# EasyEDA Pro project YTMR4040_3电阻开发板100x100mm_1028打板.eprj, schematic Schematic1
Create Date: 2023-09-04; Page Name: P1; Project Name: YTMR4040_3电阻开发板100x100mm_1028打板; Schematic Name: Schematic1; Update Date: 2024-03-18; Company: 云图半导体; Page Size: A4; Version: V1.0
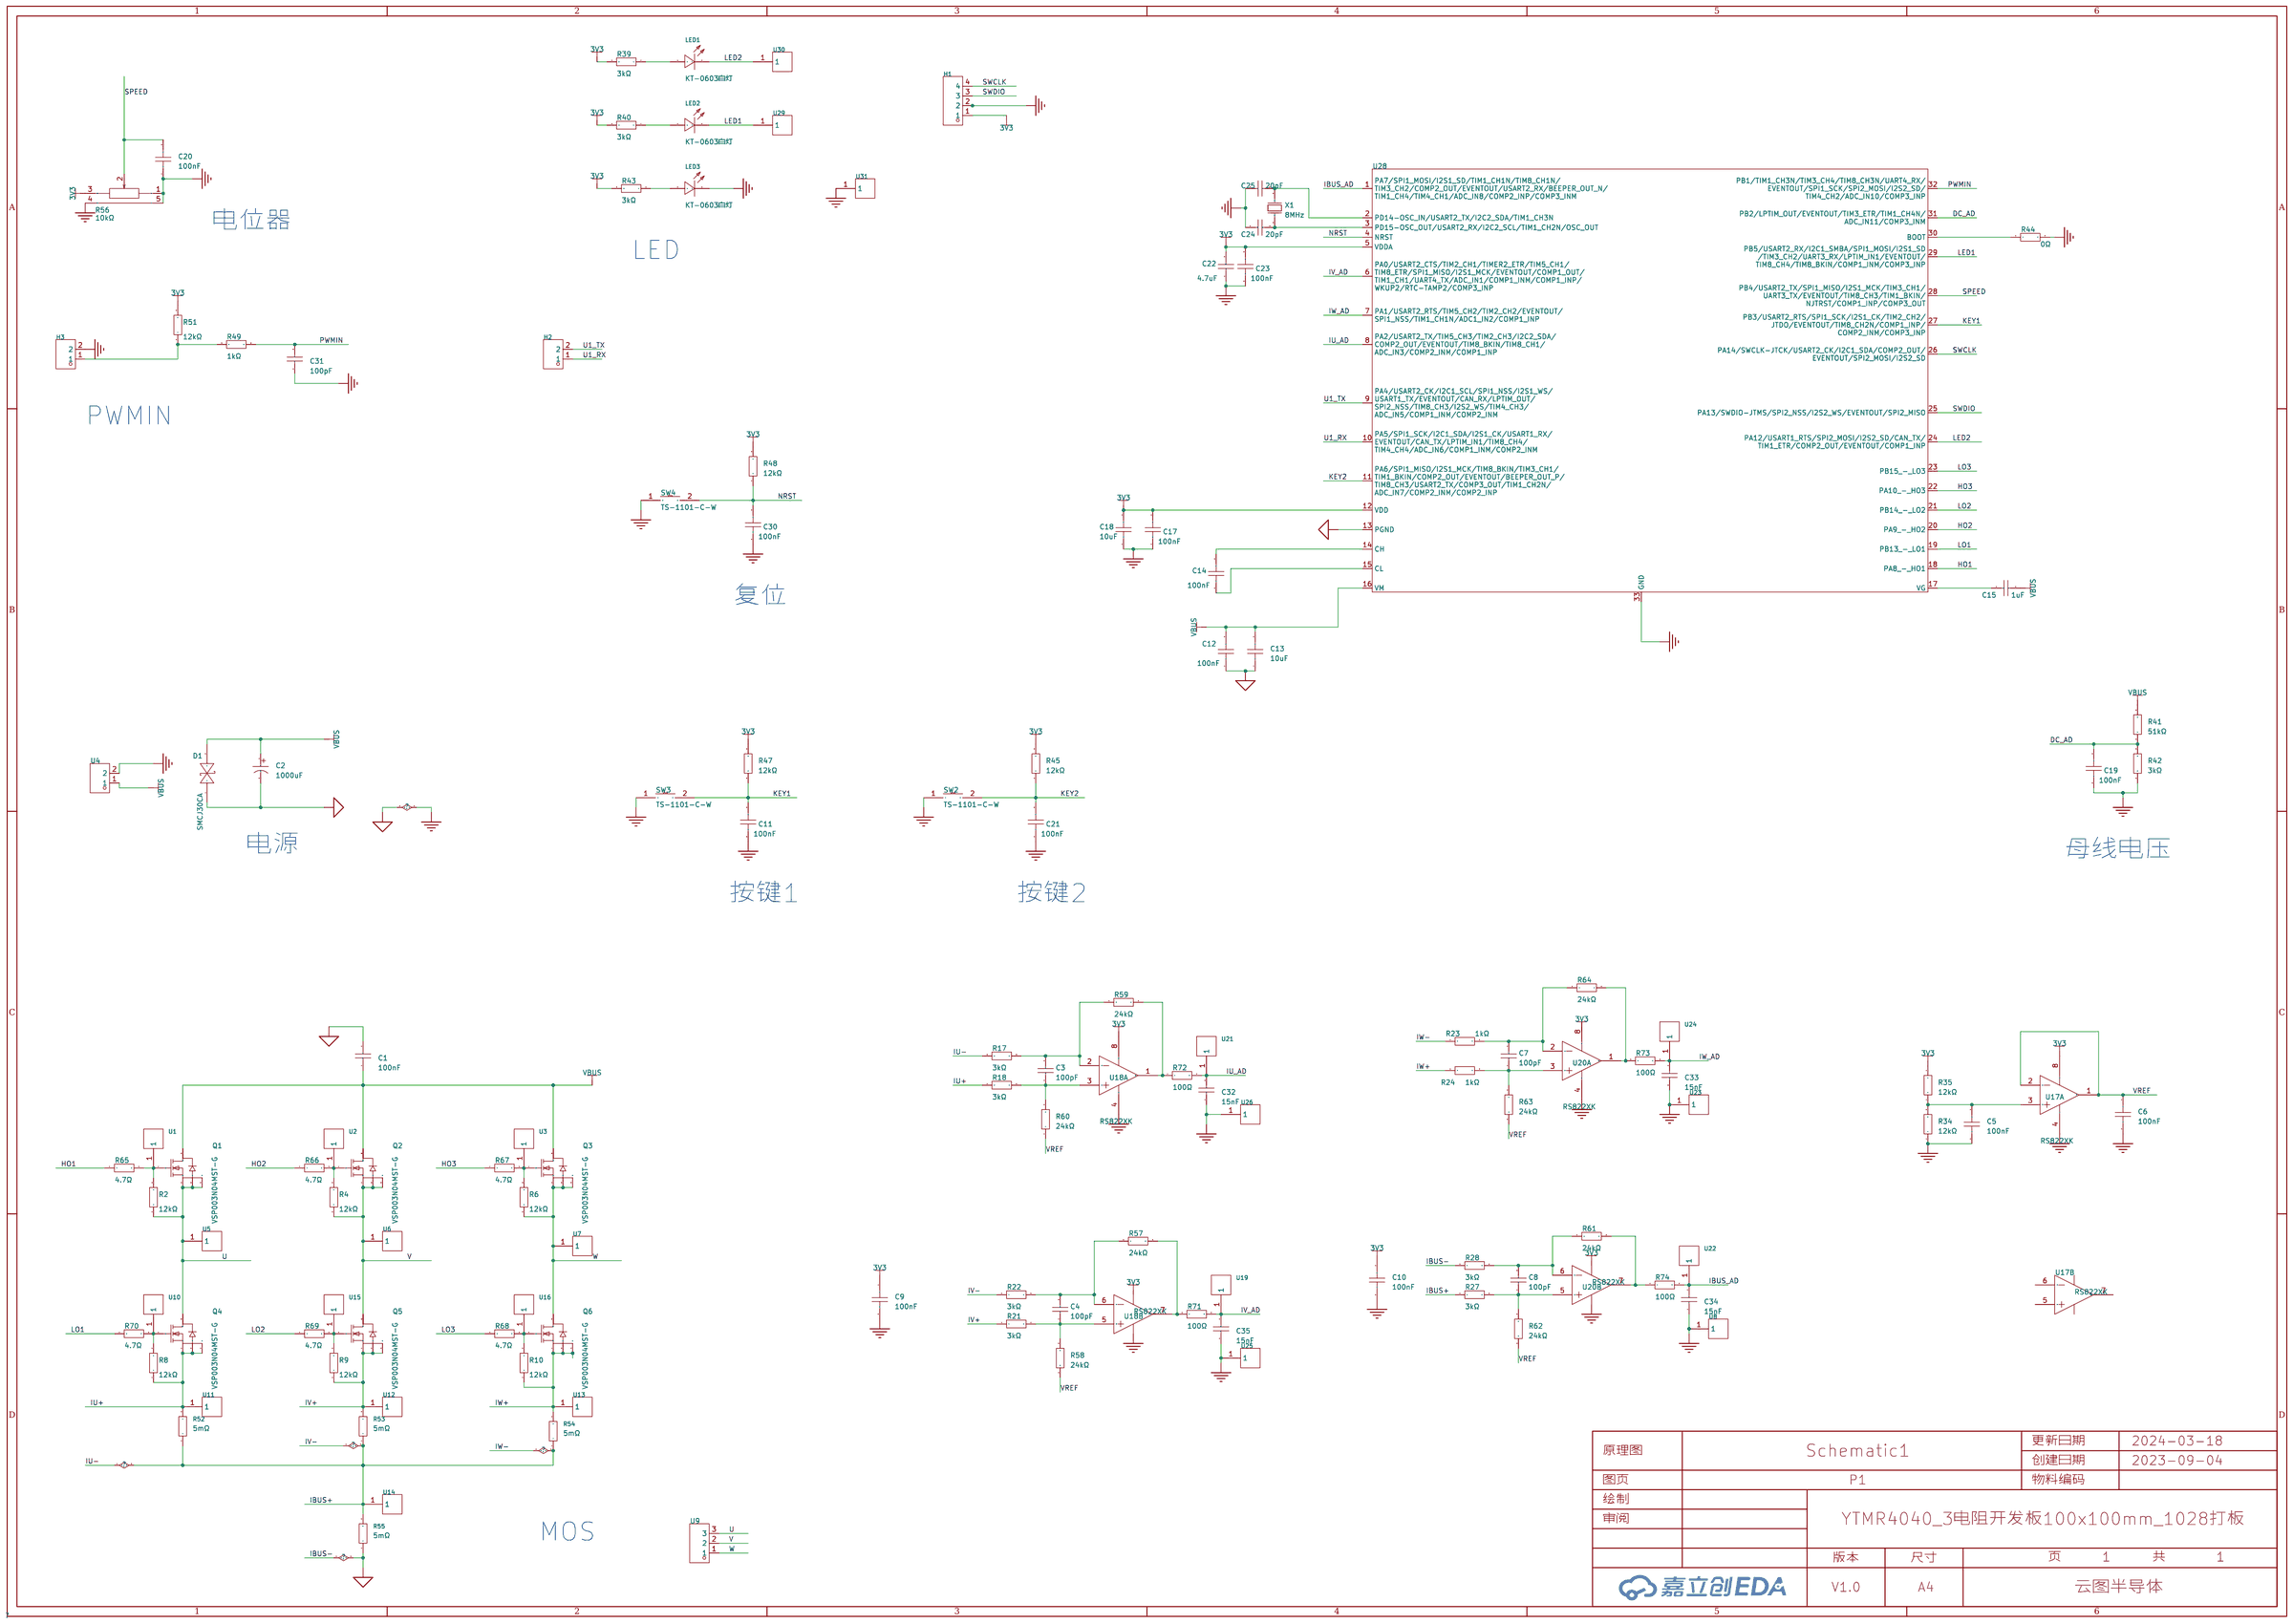
[diagram p0: schematic sheet]

## Parts
C1  100nF  [C1206]
C2  1000uF  [CAP-TH_BD12.5-P5.00-D0.6-FD]
C3  100pF  [C0603]
C4  100pF  [C0603]
C5  100nF  [C0603]
C6  100nF  [C0603]
C7  100pF  [C0603]
C8  100pF  [C0603]
C9  100nF  [C0603]
C10  100nF  [C0603]
C11  100nF  [C0603]
C12  100nF  [C0603]
C13  10uF  [C0603]
C14  100nF  [C0603]
C15  1uF  [C0603]
C17  100nF  [C0603]
C18  10uF  [C0603]
C19  100nF  [C0603]
C20  100nF  [C0603]
C21  100nF  [C0603]
C22  4.7uF  [C0603]
C23  100nF  [C0603]
C24  20pF  [C0603]
C25  20pF  [C0603]
C30  100nF  [C0603]
C31  100pF  [C0603]
C32  15nF  [C0603]
C33  15nF  [C0603]
C34  15nF  [C0603]
C35  15nF  [C0603]
D1  SMCJ30CA  [SMC_L6.9-W5.9-LS7.9-BI]
H1  X6511WV-04H-C60D30  [HDR-TH_4P-P2.54-V-M]
H2  PZ254V-11-02P  [HDR-TH_2P-P2.54-V-M]
H3  PZ254V-11-02P  [HDR-TH_2P-P2.54-V-M]
LED1  KT-0603白灯  [LED0603-R-RD_WHITE]
LED2  KT-0603白灯  [LED0603-R-RD_WHITE]
LED3  KT-0603白灯  [LED0603-R-RD_WHITE]
Q1  VSP003N04MST-G  [DFN-8_L5.8-W4.9-P1.27-LS6.1-BL]
Q2  VSP003N04MST-G  [DFN-8_L5.8-W4.9-P1.27-LS6.1-BL]
Q3  VSP003N04MST-G  [DFN-8_L5.8-W4.9-P1.27-LS6.1-BL]
Q4  VSP003N04MST-G  [DFN-8_L5.8-W4.9-P1.27-LS6.1-BL]
Q5  VSP003N04MST-G  [DFN-8_L5.8-W4.9-P1.27-LS6.1-BL]
Q6  VSP003N04MST-G  [DFN-8_L5.8-W4.9-P1.27-LS6.1-BL]
R2  12kΩ  [R0603]
R4  12kΩ  [R0603]
R6  12kΩ  [R0603]
R8  12kΩ  [R0603]
R9  12kΩ  [R0603]
R10  12kΩ  [R0603]
R17  3kΩ  [R0603]
R18  3kΩ  [R0603]
R21  3kΩ  [R0603]
R22  3kΩ  [R0603]
R23  1kΩ  [R0603]
R24  1kΩ  [R0603]
R27  3kΩ  [R0603]
R28  3kΩ  [R0603]
R34  12kΩ  [R0603]
R35  12kΩ  [R0603]
R39  3kΩ  [R0603]
R40  3kΩ  [R0603]
R41  51kΩ  [R0603]
R42  3kΩ  [R0603]
R43  3kΩ  [R0603]
R44  0Ω  [R0603]
R45  12kΩ  [R0603]
R47  12kΩ  [R0603]
R48  12kΩ  [R0603]
R49  1kΩ  [R0603]
R51  12kΩ  [R0603]
R52  5mΩ  [R2512]
R53  5mΩ  [R2512]
R54  5mΩ  [R2512]
R55  5mΩ  [R2512]
R56  10kΩ  [RES-TH_RK09K1130A70]
R57  24kΩ  [R0603]
R58  24kΩ  [R0603]
R59  24kΩ  [R0603]
R60  24kΩ  [R0603]
R61  24kΩ  [R0603]
R62  24kΩ  [R0603]
R63  24kΩ  [R0603]
R64  24kΩ  [R0603]
R65  4.7Ω  [R0603]
R66  4.7Ω  [R0603]
R67  4.7Ω  [R0603]
R68  4.7Ω  [R0603]
R69  4.7Ω  [R0603]
R70  4.7Ω  [R0603]
R71  100Ω  [R0603]
R72  100Ω  [R0603]
R73  100Ω  [R0603]
R74  100Ω  [R0603]
SW2  TS-1101-C-W  [SW-SMD_L6.0-W3.3-LS8.0]
SW3  TS-1101-C-W  [SW-SMD_L6.0-W3.3-LS8.0]
SW4  TS-1101-C-W  [SW-SMD_L6.0-W3.3-LS8.0]
U1  RH-5000  [TEST-TH_BD2.54-P1.4_RED]
U2  RH-5000  [TEST-TH_BD2.54-P1.4_RED]
U3  RH-5000  [TEST-TH_BD2.54-P1.4_RED]
U4  DB128L-5.08-2P-GN-S  [CONN-TH_2P-P5.08_DB128L-5.08-2P]
U5  RH-5000  [TEST-TH_BD2.54-P1.4_RED]
U6  RH-5000  [TEST-TH_BD2.54-P1.4_RED]
U7  RH-5000  [TEST-TH_BD2.54-P1.4_RED]
U8  RH-5000  [TEST-TH_BD2.54-P1.4_RED]
U9  XY128V-A-5.08-3P  [CONN-TH_XY128V-A-5.08-3P]
U10  RH-5000  [TEST-TH_BD2.54-P1.4_RED]
U11  RH-5000  [TEST-TH_BD2.54-P1.4_RED]
U12  RH-5000  [TEST-TH_BD2.54-P1.4_RED]
U13  RH-5000  [TEST-TH_BD2.54-P1.4_RED]
U14  RH-5000  [TEST-TH_BD2.54-P1.4_RED]
U15  RH-5000  [TEST-TH_BD2.54-P1.4_RED]
U16  RH-5000  [TEST-TH_BD2.54-P1.4_RED]
U17  RS822XK  [SOP-8_L4.9-W3.9-P1.27-LS6.0-BL]  (sections 1,2)
U18  RS822XK  [SOP-8_L4.9-W3.9-P1.27-LS6.0-BL]  (sections 1,2)
U19  RH-5000  [TEST-TH_BD2.54-P1.4_RED]
U20  RS822XK  [SOP-8_L4.9-W3.9-P1.27-LS6.0-BL]  (sections 1,2)
U21  RH-5000  [TEST-TH_BD2.54-P1.4_RED]
U22  RH-5000  [TEST-TH_BD2.54-P1.4_RED]
U23  RH-5000  [TEST-TH_BD2.54-P1.4_RED]
U24  RH-5000  [TEST-TH_BD2.54-P1.4_RED]
U25  RH-5000  [TEST-TH_BD2.54-P1.4_RED]
U26  RH-5000  [TEST-TH_BD2.54-P1.4_RED]
U28  -  [QFN-32_L4.0-W4.0-P0.40-BL-EP2.7]
U29  RH-5000  [TEST-TH_BD2.54-P1.4_RED]
U30  RH-5000  [TEST-TH_BD2.54-P1.4_RED]
U31  RH-5000  [TEST-TH_BD2.54-P1.4_RED]
X1  8MHz  [CRYSTAL-SMD_L5.0-W3.2]

## Library data of the parts
C1 = CL31B104KBCNNNC: 容值:100nF;精度:±10%;额定电压:50V;材质(温度系数):X7R;; LCSC Part Name: 100nF ±10% 50V; Supplier Part: C24497; Manufacturer: SAMSUNG(三星); Supplier Footprint: 1206; JLCPCB Part Class: 基础库; Datasheet: https://atta.szlcsc.com/upload/public/pdf/source/20160103/1457707712356.pdf; Supplier: LCSC; Tolerance: ±10%; Voltage Rated: 50V; Temperature Coefficient: X7R
C2 = ERS1VM102W20OT: 容值:1000uF;精度:±20%;额定电压:35V;; LCSC Part Name: 1000uF ±20% 35V; Supplier Part: C106695; Manufacturer: AISHI(艾华集团); Supplier Footprint: 插件,D12.5xL20mm; JLCPCB Part Class: 扩展库; Datasheet: https://atta.szlcsc.com/upload/public/pdf/source/20170415/1492238221653.pdf; Supplier: LCSC; Tolerance: ±20%; Rated Voltage: 35V; φD: 12.5mm; L: 20mm; Lead Spacing: 5mm; Lifetime @ Temp: 10000hrs@105℃
C3 C4 C7 C8 C31 = CL10C101JB8NNNC: 容值:100pF;精度:±5%;额定电压:50V;材质(温度系数):C0G;; LCSC Part Name: 100pF ±5% 50V; Supplier Part: C14858; Manufacturer: SAMSUNG(三星); Supplier Footprint: 0603; JLCPCB Part Class: 基础库; Datasheet: https://atta.szlcsc.com/upload/public/pdf/source/20160103/1457707672333.pdf; Supplier: LCSC; Tolerance: ±5%; Voltage Rated: 50V; Temperature Coefficient: C0G
C5 C6 C9-C12 C14 C17 C19-C21 C23 C30 = CC0603KRX7R9BB104: 容值:100nF;精度:±10%;额定电压:50V;材质(温度系数):X7R;; LCSC Part Name: 100nF ±10% 50V; Supplier Part: C14663; Manufacturer: YAGEO(国巨); Supplier Footprint: 0603; JLCPCB Part Class: 基础库; Datasheet: https://atta.szlcsc.com/upload/public/pdf/source/20180910/C282072_33301C7F631E79921B82A8DAC6BCC5B3.pdf; Supplier: LCSC; Tolerance: ±10%; Voltage Rated: 50V; Temperature Coefficient: X7R
C13 = GRM188R6YA106MA73D: 容值:10uF;精度:±20%;额定电压:35V;材质(温度系数):-;; LCSC Part Name: 10uF ±20% 35V; Supplier Part: C194427; Manufacturer: muRata(村田); Supplier Footprint: 0603; JLCPCB Part Class: 扩展库; Datasheet: https://atta.szlcsc.com/upload/public/pdf/source/20210128/C194427_FCA3640823207DDB58700A82F1A19B5F.pdf; Supplier: LCSC; Tolerance: ±20%; Voltage Rated: 35V
C15 = CL10A105KB8NNNC: 容值:1uF;精度:±10%;额定电压:50V;材质(温度系数):X5R;; LCSC Part Name: 1uF ±10% 50V; Supplier Part: C15849; Manufacturer: SAMSUNG(三星); Supplier Footprint: 0603; JLCPCB Part Class: 基础库; Datasheet: https://atta.szlcsc.com/upload/public/pdf/source/20160103/1457707679084.pdf; Supplier: LCSC; Tolerance: ±10%; Voltage Rated: 50V; Temperature Coefficient: X5R
C18 = CL10A106MA8NRNC: 容值:10uF;精度:±20%;额定电压:25V;材质(温度系数):X5R;; LCSC Part Name: 10uF ±20% 25V; Supplier Part: C96446; Manufacturer: SAMSUNG(三星); Supplier Footprint: 0603; JLCPCB Part Class: 基础库; Datasheet: https://atta.szlcsc.com/upload/public/pdf/source/20170325/1490427913016.pdf; Supplier: LCSC; Tolerance: ±20%; Voltage Rated: 25V; Temperature Coefficient: X5R
C22 = CL10A475KO8NNNC: 容值:4.7uF;精度:±10%;额定电压:16V;材质(温度系数):X5R;; LCSC Part Name: 4.7uF ±10% 16V; Supplier Part: C19666; Manufacturer: SAMSUNG(三星); Supplier Footprint: 0603; JLCPCB Part Class: 基础库; Datasheet: https://atta.szlcsc.com/upload/public/pdf/source/20160103/1457707703134.pdf; Supplier: LCSC; Tolerance: ±10%; Voltage Rated: 16V; Temperature Coefficient: X5R
C24 C25 = CL10C200JB8NNNC: 容值:20pF;精度:±5%;额定电压:50V;材质(温度系数):C0G;; LCSC Part Name: 20pF ±5% 50V; Supplier Part: C1648; Manufacturer: SAMSUNG(三星); Supplier Footprint: 0603; JLCPCB Part Class: 基础库; Datasheet: https://atta.szlcsc.com/upload/public/pdf/source/20160103/1457707686863.pdf; Supplier: LCSC; Tolerance: ±5%; Voltage Rated: 50V; Temperature Coefficient: C0G
C32-C35 = CC0603KRX7R9BB153: 容值:15nF;精度:±10%;额定电压:50V;材质(温度系数):X7R;; LCSC Part Name: 15nF ±10% 50V; Supplier Part: C107076; Manufacturer: YAGEO(国巨); Supplier Footprint: 0603; JLCPCB Part Class: 扩展库; Datasheet: https://atta.szlcsc.com/upload/public/pdf/source/20170420/1492670712000.pdf; Supplier: LCSC; Tolerance: ±10%; Voltage Rated: 50V; Temperature Coefficient: X7R
D1 = SMCJ30CA_C438211: 极性:双向;; LCSC Part Name: 双向; Supplier Part: C438211; Manufacturer: 晶导微电子; Supplier Footprint: SMC; JLCPCB Part Class: 扩展库; Datasheet: https://atta.szlcsc.com/upload/public/pdf/source/20191016/C438211_C3D86C316A65B072EF4CC33C301A4EED.pdf; Supplier: LCSC; Polarity: 双向
H1 = X6511WV-04H-C60D30: 排数:单排;总PIN位数:4P;间距:2.54mm;插针结构:1x4P;行距:-;安装类型:直插;圆针/方针:方针;额定电流:3A;额定电压:250V;配合针长度:6mm;塑高:2.5mm;端接针长度:3mm;触头材质:黄铜;触头镀层:金;工作温度范围:-40℃~+105℃;焊接温度(最大值):260℃;颜色:黑色;; LCSC Part Name: 2.54mm 1x4P 直插 方针 镀金足1U; Supplier Part: C706876; Manufacturer: XKB Connectivity(中国星坤); Supplier Footprint: 插件,P=2.54mm; JLCPCB Part Class: 扩展库; Datasheet: https://atta.szlcsc.com/upload/public/pdf/source/20211009/D19569EFFEB9776B42364DF7D41FD96A.pdf; Supplier: LCSC; Number of Rows: 单排; Number of Pins: 4P; Pitch: 2.54mm; Pin Structure: 1x4P; Mounting Type: 直插; Circluar Pins/Square Pins: 方针; Current Rating (Max): 3A; Voltage Rating (Max): 250V; Length of Mating Pin: 6mm; Insulation Height: 2.5mm; Length of End Connection Pin: 3mm; Contact Material: 黄铜; Contact Plating: 金; Operating Temperature Range: -40℃~+105℃; Welding Temperature (Max): 260℃; Color: 黑色
H2 H3 = PZ254V-11-02P: 排数:单排;总PIN位数:2P;间距:2.54mm;插针结构:1x2P;行距:-;安装类型:直插;圆针/方针:方针;额定电流:-;额定电压:-;配合针长度:6mm;塑高:2.5mm;端接针长度:3mm;触头材质:黄铜;触头镀层:-;工作温度范围:-40℃~+105℃;颜色:黑色;; LCSC Part Name: 2.54mm 1x2P 直插 方针; Supplier Part: C492401; Manufacturer: XFCN(兴飞); Supplier Footprint: 插件,P=2.54mm; JLCPCB Part Class: 扩展库; Datasheet: https://atta.szlcsc.com/upload/public/pdf/source/20200309/C492401_A812433581A9B211A7FFA413ADDFF0E5.pdf; Supplier: LCSC; Number of Rows: 单排; Number of Pins: 2P; Pitch: 2.54mm; Pin Structure: 1x2P; Mounting Type: 直插; Circluar Pins/Square Pins: 方针; Length of Mating Pin: 6mm; Insulation Height: 2.5mm; Length of End Connection Pin: 3mm; Contact Material: 黄铜; Operating Temperature Range: -40℃~+105℃; Color: 黑色
LED1-LED3 = KT-0603白灯: 发光颜色:白灯;; LCSC Part Name: 白灯; Supplier Part: C2290; Manufacturer: KENTO; Supplier Footprint: 0603; JLCPCB Part Class: 基础库; Datasheet: https://atta.szlcsc.com/upload/public/pdf/source/20221101/4C23D5C85BA051E44A00B833D0A41468.pdf; Supplier: LCSC; Emitted Color: 白灯
Q1-Q6 = VSP003N04MST-G: Supplier Part: C3036325; Manufacturer: Vanguard(威兆); Supplier Footprint: PDFN(5x6); JLCPCB Part Class: 扩展库; Datasheet: https://atta.szlcsc.com/upload/public/pdf/source/20220701/5CA2F2D6E876D66CB510B877AFB42165.pdf; Supplier: LCSC
R2 R4 R6 R8-R10 R34 R35 R45 R47 R48 R51 = 0603WAF1202T5E: 电阻类型:厚膜电阻;阻值:12kΩ;精度:±1%;功率:100mW;; LCSC Part Name: 12kΩ ±1% 100mW; Supplier Part: C22790; Manufacturer: UNI-ROYAL(厚声); Supplier Footprint: 0603; JLCPCB Part Class: 基础库; Datasheet: https://atta.szlcsc.com/upload/public/pdf/source/20200306/C422600_1E6D84923E4A46A82E41ADD87F860B5C.pdf; Supplier: LCSC; Type: 厚膜电阻; Tolerance: ±1%; Power(Watts): 100mW; Temperature Coefficient: ±100ppm/℃; Overload Voltage (Max): 75V; Operating Temperature Range: -55℃~+155℃
R17 R18 R21 R22 R27 R28 R39 R40 R42 R43 = 0603WAF3001T5E: 电阻类型:厚膜电阻;阻值:3kΩ;精度:±1%;功率:100mW;; LCSC Part Name: 3kΩ ±1% 100mW; Supplier Part: C4211; Manufacturer: UNI-ROYAL(厚声); Supplier Footprint: 0603; JLCPCB Part Class: 基础库; Datasheet: https://atta.szlcsc.com/upload/public/pdf/source/20200306/C422600_1E6D84923E4A46A82E41ADD87F860B5C.pdf; Supplier: LCSC; Type: 厚膜电阻; Tolerance: ±1%; Power(Watts): 100mW; Temperature Coefficient: ±100ppm/℃; Overload Voltage (Max): 75V; Operating Temperature Range: -55℃~+155℃
R23 R24 R49 = 0603WAF1001T5E: 电阻类型:厚膜电阻;阻值:1kΩ;精度:±1%;功率:100mW;; LCSC Part Name: 1kΩ ±1% 100mW; Supplier Part: C21190; Manufacturer: UNI-ROYAL(厚声); Supplier Footprint: 0603; JLCPCB Part Class: 基础库; Datasheet: https://atta.szlcsc.com/upload/public/pdf/source/20200306/C422600_1E6D84923E4A46A82E41ADD87F860B5C.pdf; Supplier: LCSC; Type: 厚膜电阻; Tolerance: ±1%; Power(Watts): 100mW; Temperature Coefficient: ±100ppm/℃; Overload Voltage (Max): 75V; Operating Temperature Range: -55℃~+155℃
R41 = RC0603FR-0751KL: 电阻类型:厚膜电阻;阻值:51kΩ;精度:±1%;功率:100mW;; LCSC Part Name: 51kΩ ±1% 100mW; Supplier Part: C107231; Manufacturer: YAGEO(国巨); Supplier Footprint: 0603; JLCPCB Part Class: 扩展库; Datasheet: https://atta.szlcsc.com/upload/public/pdf/source/20170818/C107231_1503051113432895060.pdf; Supplier: LCSC; Type: 厚膜电阻; Tolerance: ±1%; Power(Watts): 100mW; Temperature Coefficient: ±100ppm/℃; Overload Voltage (Max): 75V; Operating Temperature Range: -55℃~+155℃
R44 = 0603WAF0000T5E: 电阻类型:厚膜电阻;阻值:0Ω;精度:±1%;功率:100mW;; LCSC Part Name: 0Ω ±1% 100mW; Supplier Part: C21189; Manufacturer: UNI-ROYAL(厚声); Supplier Footprint: 0603; JLCPCB Part Class: 基础库; Datasheet: https://atta.szlcsc.com/upload/public/pdf/source/20200306/C422600_1E6D84923E4A46A82E41ADD87F860B5C.pdf; Supplier: LCSC; Type: 厚膜电阻; Tolerance: ±1%; Power(Watts): 100mW; Overload Voltage (Max): 75V; Operating Temperature Range: -55℃~+155℃
R52-R55 = PA2512FKF7W0R005E: 阻值:5mΩ;精度:±1%;功率:2W;温度系数:±100ppm/℃;; LCSC Part Name: 5mΩ ±1% 2W; Supplier Part: C309526; Manufacturer: YAGEO(国巨); Supplier Footprint: 2512; JLCPCB Part Class: 扩展库; Datasheet: 2021-12-08/368957A/03f3994f60e24802928f00b13688e15a/PA2512FKF7W0R005E.PDF; Supplier: LCSC; Tolerance: ±1%; Power(Watts): 2W; Temperature Coefficient: ±100ppm/℃
R56 = RK09K1130A70: 阻值:10kΩ;精度:±20%;; LCSC Part Name: 10kΩ ±20%; Supplier Part: C351173; Manufacturer: ALPSALPINE(阿尔卑斯阿尔派); Supplier Footprint: 插件; JLCPCB Part Class: 扩展库; Datasheet: https://atta.szlcsc.com/upload/public/pdf/source/20190114/C351173_C906DEBA325EF480E9D499DB4D5E6863.pdf; Supplier: LCSC; Tolerance: ±20%
R57-R64 = 0603WAF2402T5E: 电阻类型:厚膜电阻;阻值:24kΩ;精度:±1%;功率:100mW;温度系数:±100ppm/℃;; LCSC Part Name: 厚膜电阻 24kΩ ±1% 100mW; Supplier Part: C23352; Manufacturer: UNI-ROYAL(厚声); Supplier Footprint: 0603; JLCPCB Part Class: 基础库; Datasheet: https://atta.szlcsc.com/upload/public/pdf/source/20200306/C422600_1E6D84923E4A46A82E41ADD87F860B5C.pdf; Supplier: LCSC; Type: 厚膜电阻; Tolerance: ±1%; Power(Watts): 100mW; Temperature Coefficient: ±100ppm/℃; Overload Voltage (Max): 75V; Operating Temperature Range: -55℃~+155℃
R65-R70 = 0603WAF470KT5E: 电阻类型:厚膜电阻;阻值:4.7Ω;精度:±1%;功率:100mW;温度系数:±400ppm/℃;; LCSC Part Name: 厚膜电阻 4.7Ω ±1% 100mW; Supplier Part: C23164; Manufacturer: UNI-ROYAL(厚声); Supplier Footprint: 0603; JLCPCB Part Class: 基础库; Datasheet: https://atta.szlcsc.com/upload/public/pdf/source/20200306/C422600_1E6D84923E4A46A82E41ADD87F860B5C.pdf; Supplier: LCSC; Type: 厚膜电阻; Tolerance: ±1%; Power(Watts): 100mW; Temperature Coefficient: ±400ppm/℃; Overload Voltage (Max): 75V; Operating Temperature Range: -55℃~+155℃
R71-R74 = 0603WAF1000T5E: 电阻类型:厚膜电阻;阻值:100Ω;精度:±1%;功率:100mW;; LCSC Part Name: 100Ω ±1% 100mW; Supplier Part: C22775; Manufacturer: UNI-ROYAL(厚声); Supplier Footprint: 0603; JLCPCB Part Class: 基础库; Datasheet: https://atta.szlcsc.com/upload/public/pdf/source/20200306/C422600_1E6D84923E4A46A82E41ADD87F860B5C.pdf; Supplier: LCSC; Type: 厚膜电阻; Tolerance: ±1%; Power(Watts): 100mW; Temperature Coefficient: ±200ppm/℃; Overload Voltage (Max): 75V; Operating Temperature Range: -55℃~+155℃
SW2-SW4 = TS-1101-C-W: 触点电流:50mA;额定电压(AC):-;额定电压(DC):12V;额定功率:-;绝缘电阻:-;电路结构:单刀单掷;安装方式:立贴;带灯:无;作用力:260gf;机械寿命:5万次;带支架:否;; LCSC Part Name: 立贴 6*3.6*2.5mm 轻触开关 一型3*6*2.5有白ZD b拉伸白色带淡绿按键 卷装; Supplier Part: C318938; Manufacturer: XKB Connectivity(中国星坤); Supplier Footprint: SMD; JLCPCB Part Class: 扩展库; Datasheet: https://atta.szlcsc.com/upload/public/pdf/source/20200227/C318938_C2E53B1EEDE37D980A33616AC086DE53.pdf; Supplier: LCSC; Contact Current: 50mA; Voltage Rating (DC): 12V; Circuit: 单刀单掷; Mounting Style: 立贴; Actuator Style: 矩形按钮; Actuator/Cap Color: 白色带淡绿; With Lamp: 无; Operating Force: 260gf; Mechanical Life: 5万次; Operating Temperature: -30℃~+85℃; Switch Length: 6mm; Switch Width: 3.6mm; Switch Height: 2.5mm; Strike Gundam: 否
U1-U3 U5-U8 U10-U16 U19 U21-U26 U29-U31 = RH-5000: 100x80mm; LCSC Part Name: PCB电路板测试点/测试针; Supplier Part: C5277086; Manufacturer: 荣和; JLCPCB Part Class: 扩展库; Datasheet: https://atta.szlcsc.com/upload/public/pdf/source/20230704/1671C2774A3D6CEDC1FD6AAF48538C87.pdf; Supplier: LCSC
U4 = DB128L-5.08-2P-GN-S: 间距:5.08mm;排数:1;每排PIN数:2;安装方式:直针;额定电流:18A;额定电压:250V;线规 - AWG:12~30;线规 - mm?:2.5;工作温度范围:-40℃~+105℃;颜色:绿色;; LCSC Part Name: 5.08mm 排数:1 每排P数:2 直针; Supplier Part: C395868; Manufacturer: DIBO(地博电气); Supplier Footprint: 直插,P=5.08mm; JLCPCB Part Class: 扩展库; Datasheet: https://atta.szlcsc.com/upload/public/pdf/source/20190611/C395868_9F3E17C88C37076AB29EAFE95D0B378F.pdf; Supplier: LCSC; Pitch: 5.08mm; Number of Rows: 1; Number of PINs Per Row: 2; Mounting Style: 直针; Current Rating (Max): 18A; Voltage Rating (Max): 250V; Wire Gauge - AWG: 12~30; Wire Gauge - mm?: 2.5; Operating Temperature Range: -40℃~+105℃; Color: 绿色
U9 = XY128V-A-5.08-3P: 间距:5.08mm;排数:1;每排PIN数:3;安装方式:直针;额定电流:15A;额定电压:300V;线规 - AWG:12~24;线规 - mm2:2.5;工作温度范围:-;颜色:绿色;; LCSC Part Name: 5.08mm 排数:1 每排P数:3 直针; Supplier Part: C557666; Manufacturer: XINLAIYA(新莱亚); Supplier Footprint: 直插,P=5.08mm; JLCPCB Part Class: 扩展库; Datasheet: https://atta.szlcsc.com/upload/public/pdf/source/20200527/C557663_965673E12F0DA50AFE0C050081E55359.pdf; Supplier: LCSC; Pitch: 5.08mm; Number of Rows: 1; Number of PINs Per Row: 3; Mounting Style: 直针; Current Rating (Max): 15A; Voltage Rating (Max): 300V; Wire Gauge - AWG: 12~24; Wire Gauge - mm2: 2.5; Color: 绿色
U17 U18 U20 = RS822XK: 超低噪声8.5nV/√Hz,14MHz,2通道运放; LCSC Part Name: 低噪声运放RS822XK; Supplier Part: C255443; Manufacturer: RUNIC(润石); Supplier Footprint: SOP-8; JLCPCB Part Class: 扩展库; Datasheet: https://atta.szlcsc.com/upload/public/pdf/source/20180801/C255443_25EF0C0986B057D697399C535340406F.pdf; Supplier: LCSC
U28 = YTMR4040QF_1.0
X1 = X50328MSB2GI: 频率:8MHz;频率公差:±10ppm;负载电容:20pF;; LCSC Part Name: 8MHz ±10ppm 20pF YSX530GA YSX530GA; Supplier Part: C115962; Manufacturer: YXC(扬兴晶振); Supplier Footprint: SMD5032-2P; JLCPCB Part Class: 基础库; Datasheet: https://atta.szlcsc.com/upload/public/pdf/source/20230220/0EBFFB9D6D8CE6A211407822BBB6C516.pdf; Supplier: LCSC; Crystal Type: 贴片无源晶振; Frequency Tolerance: ±10ppm; Frequency Stability: ±50ppm; Load Capacitance: 20pF; Operating Temperature: -40℃~+85℃

## Nets
3V3: C9.1 C10.1 C17.2 C18.2 C22.2 C23.2 H1.1 R35.2 R39.2 R40.2 R43.2 R45.2 R47.2 R48.2 R51.2 R56.3 U17.8(V+) U18.8(V+) U20.8(V+) U28.5(VDDA) U28.12(VDD)
AGND: C1.2 C2.2 C5.2 C6.2 C9.2 C10.2 C11.1 C12.1 C13.1 C17.1 C18.1 C19.1 C20.1 C21.1 C22.1 C23.1 C24.2 C25.2 C30.1 C31.1 C32.1 C33.2 C34.1 C35.1 D1.1 H1.2 H3.2 LED3.2(K) R28.1 R34.1 R42.1 R44.2 R55.1 R56.1 R56.4(EH) R56.5(EH) SW2.1 SW3.1 SW4.1 U4.2 U8.1 U17.4(V-) U18.4(V-) U20.4(V-) U23.1 U25.1 U26.1 U28.13(PGND) U28.33(GND) U31.1
VBUS: C1.1 C2.1 C12.2 C13.2 C15.1 D1.2 Q1.5(D) Q1.6(D) Q1.7(D) Q1.8(D) Q1.9(D) Q2.5(D) Q2.6(D) Q2.7(D) Q2.8(D) Q2.9(D) Q3.5(D) Q3.6(D) Q3.7(D) Q3.8(D) Q3.9(D) R41.2 U4.1 U28.16(VM)
DC_AD: C19.2 R41.1 R42.2 U28.31(PB2/LPTIM_OUT/EVENTOUT/TIM3_ETR/TIM1_CH4N/
ADC_IN11/COMP3_INM)
HO1: R65.1 U28.18(PA8 - HO1)
HO2: R66.1 U28.20(PA9 - HO2)
HO3: R67.1 U28.22(PA10 - HO3)
IBUS+: R17.1 R22.1 R23.1 R27.1 R52.1 R53.1 R54.1 R55.2 U14.1
IBUS_AD: C34.2 R74.2 U22.1 U28.1(PA7/SPI1_MOSI/I2S1_SD/TIM1_CH1N/TIM8_CH1N/
TIM3_CH2/COMP2_OUT/EVENTOUT/USART2_RX/BEEPER_OUT_N/
TIM1_CH4/TIM4_CH1/ADC_IN8/COMP2_INP/COMP3_INM)
IU+: Q4.1(S) Q4.2(S) Q4.3(S) R8.1 R18.1 R52.2 U11.1
IU_AD: C32.2 R72.2 U21.1 U28.8(PA2/USART2_TX/TIM5_CH3/TIM2_CH3/I2C2_SDA/
COMP2_OUT/EVENTOUT/TIM8_BKIN/TIM8_CH1/
ADC_IN3/COMP2_INM/COMP1_INP)
IV+: Q5.1(S) Q5.2(S) Q5.3(S) R9.1 R21.1 R53.2 U12.1
IV_AD: C35.2 R71.2 U19.1 U28.6(PA0/USART2_CTS/TIM2_CH1/TIMER2_ETR/TIM5_CH1/
TIM8_ETR/SPI1_MISO/I2S1_MCK/EVENTOUT/COMP1_OUT/
TIM1_CH1/UART4_TX/ADC_IN1/COMP1_INM/COMP1_INP/
WKUP2/RTC-TAMP2/COMP3_INP)
IW+: Q6.1(S) Q6.2(S) Q6.3(S) R10.1 R24.1 R54.2 U13.1
IW_AD: C33.1 R73.2 U24.1 U28.7(PA1/USART2_RTS/TIM5_CH2/TIM2_CH2/EVENTOUT/
SPI1_NSS/TIM1_CH1N/ADC1_IN2/COMP1_INP)
KEY1: C11.2 R47.1 SW3.2 U28.27(PB3/USART2_RTS/SPI1_SCK/I2S1_CK/TIM2_CH2/
JTDO/EVENTOUT/TIM8_CH2N/COMP1_INP/
COMP2_INM/COMP3_INP)
KEY2: C21.2 R45.1 SW2.2 U28.11(PA6/SPI1_MISO/I2S1_MCK/TIM8_BKIN/TIM3_CH1/
TIM1_BKIN/COMP2_OUT/EVENTOUT/BEEPER_OUT_P/
TIM8_CH3/USART2_TX/COMP3_OUT/TIM1_CH2N/
ADC_IN7/COMP2_INM/COMP2_INP)
LED1: LED2.2(K) U28.29(PB5/USART2_RX/I2C1_SMBA/SPI1_MOSI/I2S1_SD
/TIM3_CH2/UART3_RX/LPTIM_IN1/EVENTOUT/
TIM8_CH4/TIM8_BKIN/COMP1_INM/COMP3_INP) U29.1
LED2: LED1.2(K) U28.24(PA12/USART1_RTS/SPI2_MOSI/I2S2_SD/CAN_TX/
TIM1_ETR/COMP2_OUT/EVENTOUT/COMP1_INP) U30.1
LO1: R70.1 U28.19(PB13 - LO1)
LO2: R69.1 U28.21(PB14 - LO2)
LO3: R68.1 U28.23(PB15 - LO3)
NRST: C30.2 R48.1 SW4.2 U28.4(NRST)
PWMIN: C31.2 R49.2 U28.32(PB1/TIM1_CH3N/TIM3_CH4/TIM8_CH3N/UART4_RX/
EVENTOUT/SPI1_SCK/SPI2_MOSI/I2S2_SD/
TIM4_CH2/ADC_IN10/COMP3_INP)
SPEED: C20.2 R56.2 U28.28(PB4/USART2_TX/SPI1_MISO/I2S1_MCK/TIM3_CH1/
UART3_TX/EVENTOUT/TIM8_CH3/TIM1_BKIN/
NJTRST/COMP1_INP/COMP3_OUT)
SWCLK: H1.4 U28.26(PA14/SWCLK-JTCK/USART2_CK/I2C1_SDA/COMP2_OUT/
EVENTOUT/SPI2_MOSI/I2S2_SD)
SWDIO: H1.3 U28.25(PA13/SWDIO-JTMS/SPI2_NSS/I2S2_WS/EVENTOUT/SPI2_MISO)
U: Q1.1(S) Q1.2(S) Q1.3(S) Q4.5(D) Q4.6(D) Q4.7(D) Q4.8(D) Q4.9(D) R2.1 U5.1 U9.3
U1_RX: H2.1 U28.10(PA5/SPI1_SCK/I2C1_SDA/I2S1_CK/USART1_RX/
EVENTOUT/CAN_TX/LPTIM_IN1/TIM8_CH4/
TIM4_CH4/ADC_IN6/COMP1_INM/COMP2_INM)
U1_TX: H2.2 U28.9(PA4/USART2_CK/I2C1_SCL/SPI1_NSS/I2S1_WS/
USART1_TX/EVENTOUT/CAN_RX/LPTIM_OUT/
SPI2_NSS/TIM8_CH3/I2S2_WS/TIM4_CH3/
ADC_IN5/COMP1_INM/COMP2_INM)
V: Q2.1(S) Q2.2(S) Q2.3(S) Q5.5(D) Q5.6(D) Q5.7(D) Q5.8(D) Q5.9(D) R4.1 U6.1 U9.2
VREF: C6.1 R58.1 R60.1 R62.1 R63.2 U17.1(OUTA) U17.2(-INA)
W: Q3.1(S) Q3.2(S) Q3.3(S) Q6.5(D) Q6.6(D) Q6.7(D) Q6.8(D) Q6.9(D) R6.1 U7.1 U9.1
$1N3251: Q1.4(G) R2.2 R65.2 U1.1
$1N3568: Q4.4(G) R8.2 R70.2 U10.1
$1N4479: Q2.4(G) R4.2 R66.2 U2.1
$1N4481: Q5.4(G) R9.2 R69.2 U15.1
$1N4771: Q3.4(G) R6.2 R67.2 U3.1
$1N4773: Q6.4(G) R10.2 R68.2 U16.1
$1N49414: C7.1 R24.2 R63.1 U20.3(+INA)
$1N49682: R64.2 R73.1 U20.1(OUTA)
$1N49683: C7.2 R23.2 R64.1 U20.2(-INA)
$1N50367: C3.1 R18.2 R60.2 U18.3(+INA)
$1N50382: R59.2 R72.1 U18.1(OUTA)
$1N50386: C3.2 R17.2 R59.1 U18.2(-INA)
$1N50869: C4.1 R21.2 R58.2 U18.5(+INB)
$1N50885: R57.2 R71.1 U18.7(OUTB)
$1N50889: C4.2 R22.2 R57.1 U18.6(-INB)
$1N51493: H3.1 R49.1 R51.1
$1N52620: C15.2 U28.17(VG)
$1N52636: R44.1 U28.30(BOOT)
$1N52663: C14.2 U28.14(CH)
$1N52664: C14.1 U28.15(CL)
$1N52684: C24.1 U28.3(PD15-OSC_OUT/USART2_RX/I2C2_SCL/TIM1_CH2N/OSC_OUT) X1.2(OSC2)
$1N52686: C25.1 U28.2(PD14-OSC_IN/USART2_TX/I2C2_SDA/TIM1_CH3N) X1.1(OSC1)
$1N52714: LED2.1(A) R40.1
$1N56722: LED3.1(A) R43.1
$1N56854: LED1.1(A) R39.1
$1N57631: C5.1 R34.2 R35.1 U17.3(+INA)
$1N57781: C8.1 R27.2 R62.2 U20.5(+INB)
$1N57838: R61.2 R74.1 U20.7(OUTB)
$1N57839: C8.2 R28.2 R61.1 U20.6(-INB)

Not connected (* = marked no-connect by the designer): U17 5(+INB) 6(-INB) 7(OUTB)

## Notes on the sheet
- 电位器
- LED
- PWMIN
- 复位
- 电源
- 母线电压
- 按键1
- 按键2
- MOS
